# Altium schematic sheet 38-TEST HEADER.SchDoc
size 513 x 386 mm
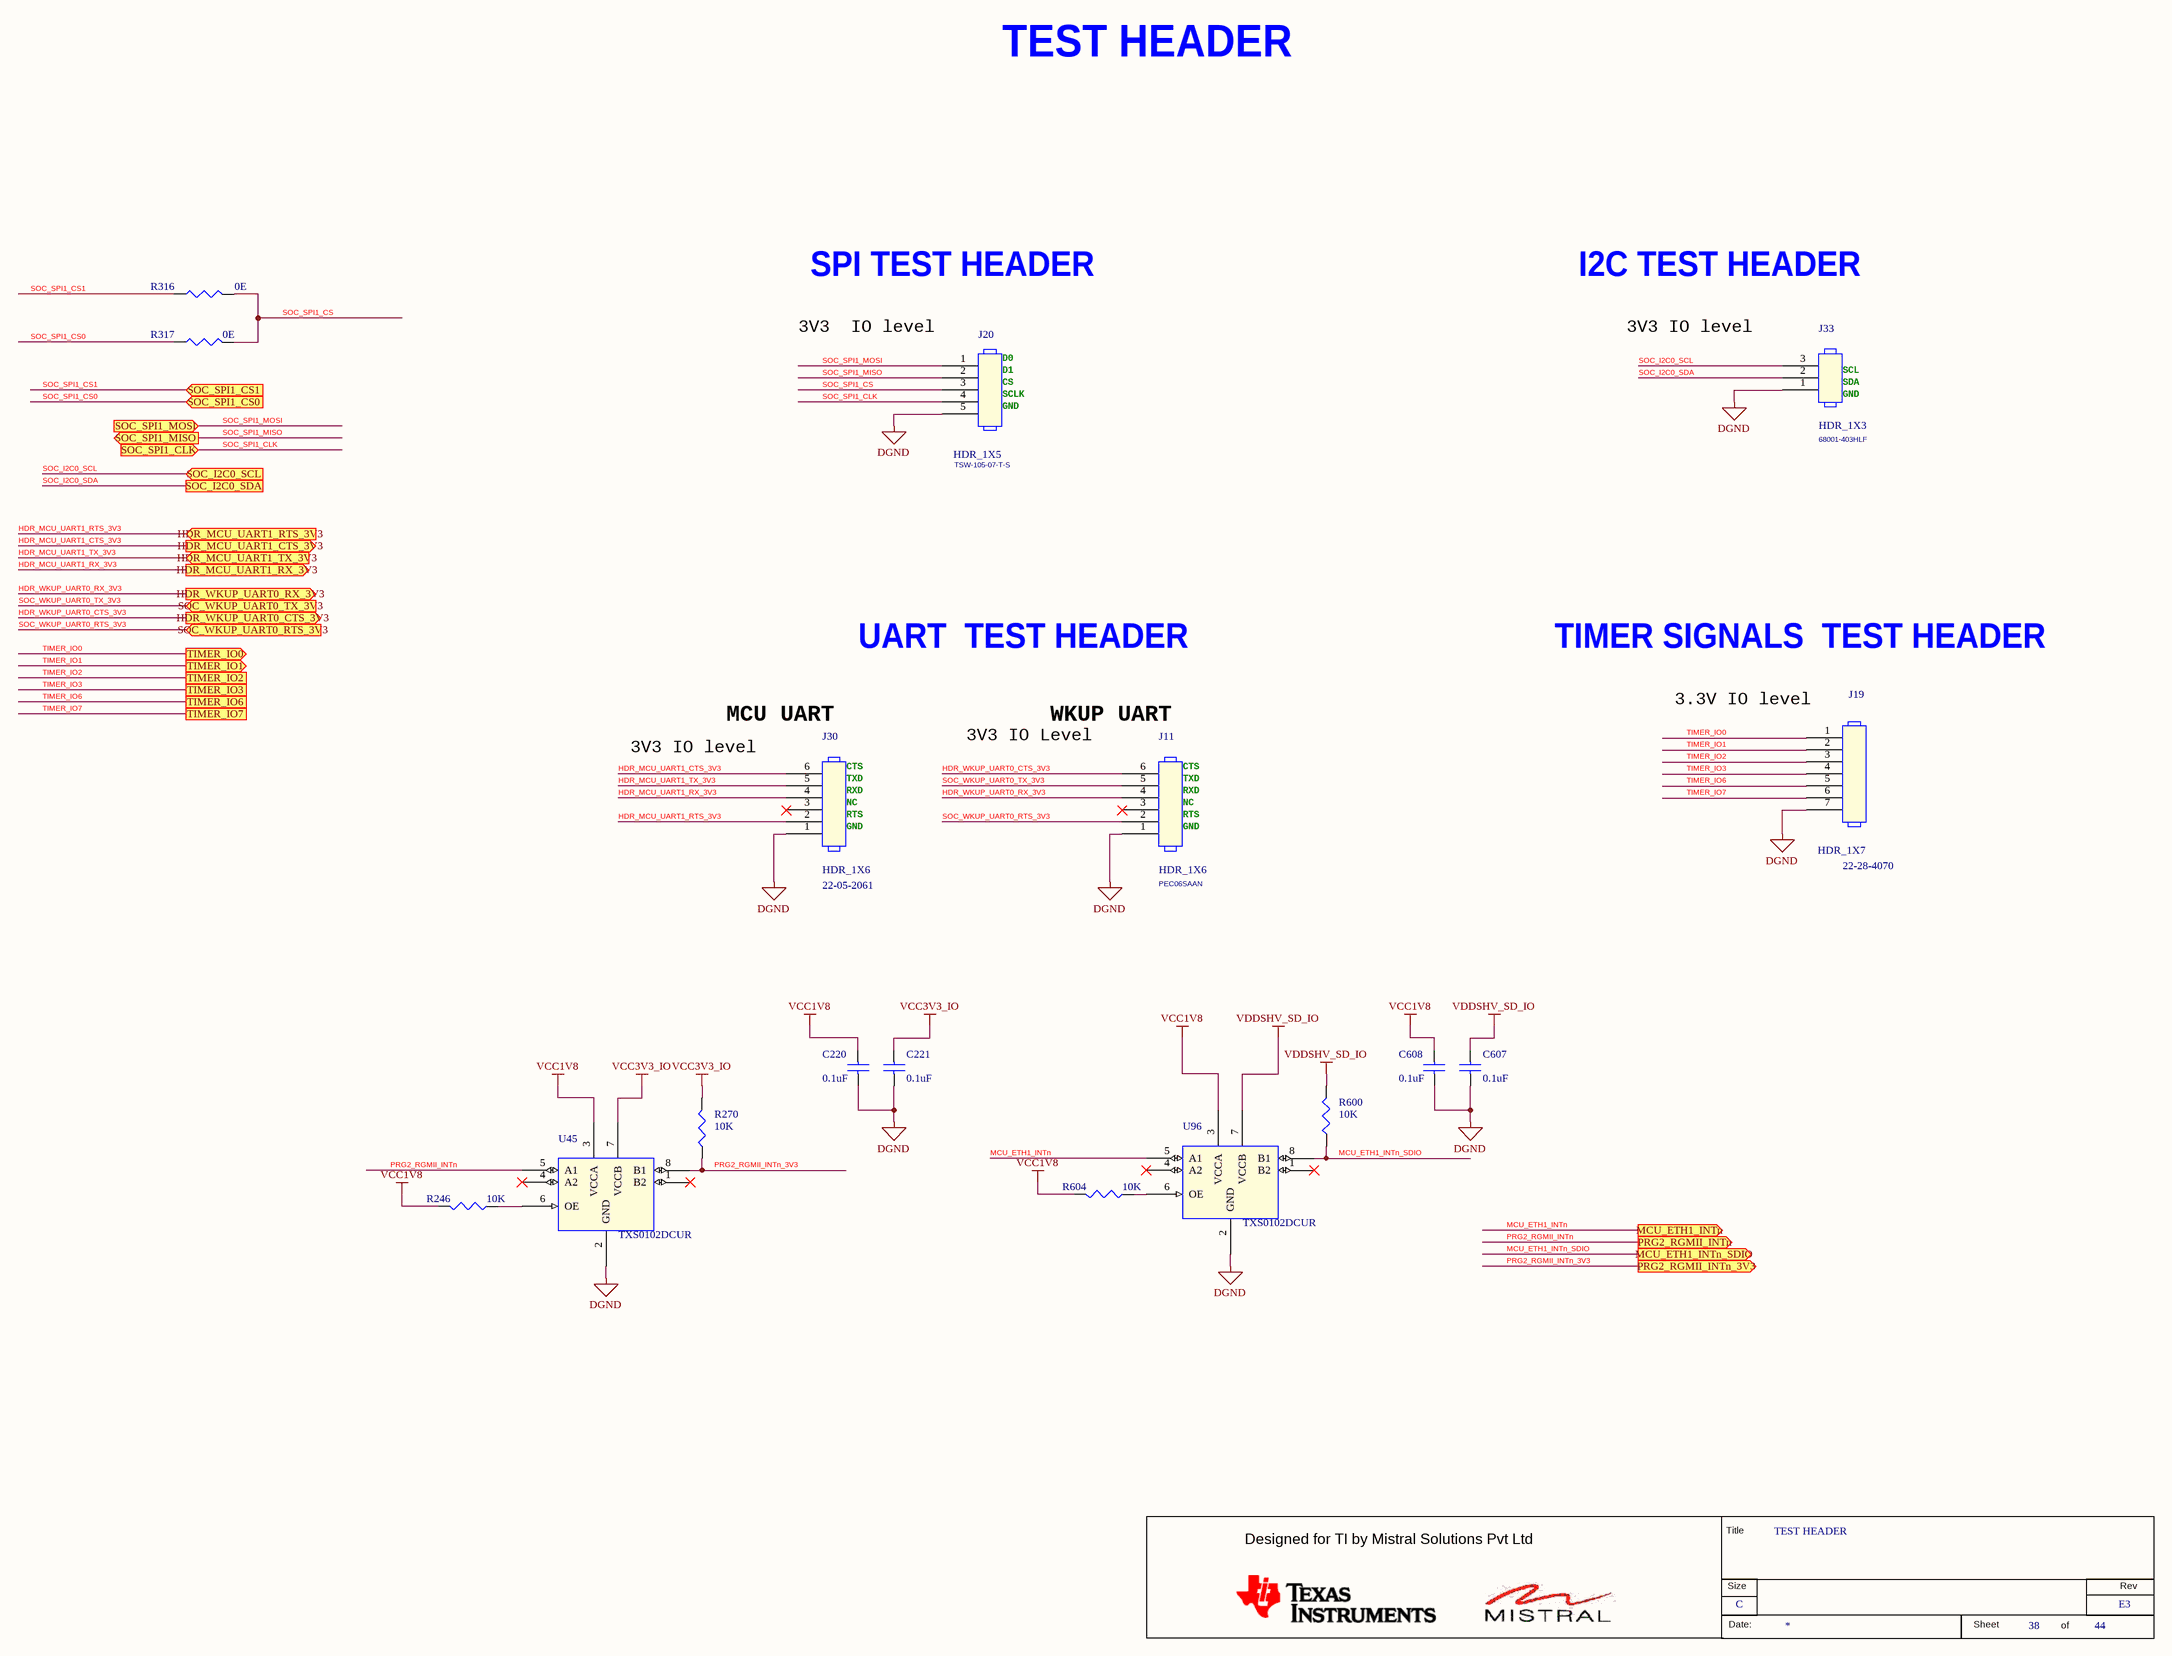
[diagram p0: 38-TEST HEADER.SchDoc]

## Parts
*  RevCode: E3  Title: TEST HEADER  Page Size: C  Page Number: 38  Page Count: 44  (hidden comment: MISTRAL_TITLEBLK_CSIZE)  (graphical)
C220  0.1uF  [CAP0201_0-5]
C221  0.1uF  [CAP0201_0-5]
C607  0.1uF  [CAP0201_0-5]
C608  0.1uF  [CAP0201_0-5]
J11  HDR_1X6  Mfr_part_number: PEC06SAAN  [HDR_6X1_100_S_T]
J19  HDR_1X7  Mfr_part_number: 22-28-4070  [HDR_1X7_22284070_S_T_8-4]
J20  HDR_1X5  Mfr_part_number: TSW-105-07-T-S  [HDR_5X1_100_S_T_8-4]
J30  HDR_1X6  Mfr_part_number: 22-05-2061  [HDR_1X6_22052061_R_T_6-3]
J33  HDR_1X3  Mfr_part_number: 68001-403HLF  [HDR_3X1_100_S_T]
R246  10K  [RES0402_0-5]
R270  10K  [RES0402_0-5]
R316  0E  [RES0402_0-5]
R317  0E  [RES0402_0-5]
R600  10K  [RES0402_0-5]
R604  10K  [RES0402_0-5]
U45  TXS0102DCUR  [VSSOP8_19-68_85X95_0-9]
U96  TXS0102DCUR  [VSSOP8_19-68_85X95_0-9]

## Ports
HDR_MCU_UART1_CTS_3V3 (out), HDR_MCU_UART1_RTS_3V3 (in), HDR_MCU_UART1_RX_3V3 (out), HDR_MCU_UART1_TX_3V3 (in), HDR_WKUP_UART0_CTS_3V3 (out), HDR_WKUP_UART0_RX_3V3 (out), MCU_ETH1_INTn (out), MCU_ETH1_INTn_SDIO (out), PRG2_RGMII_INTn (out), PRG2_RGMII_INTn_3V3 (out), SOC_I2C0_SCL (in), SOC_I2C0_SDA, SOC_SPI1_CLK (in), SOC_SPI1_CS0 (in), SOC_SPI1_CS1 (in), SOC_SPI1_MISO (out), SOC_SPI1_MOSI (in), SOC_WKUP_UART0_RTS_3V3 (in), SOC_WKUP_UART0_TX_3V3 (in), TIMER_IO0 (out), TIMER_IO1 (out), TIMER_IO2, TIMER_IO3, TIMER_IO6, TIMER_IO7

## Nets
DGND: C220.2 C221.2 C607.2 C608.2 J11.1 J19.7 J20.5 J30.1 J33.1 U45.2(GND) U96.2(GND)
VCC1V8: C220.1 C608.1 R246.2 R604.2 U45.3(VCCA) U96.3(VCCA)
VCC3V3_IO: C221.1 R270.2 U45.7(VCCB)
VDDSHV_SD_IO: C607.1 R600.2 U96.7(VCCB)
HDR_MCU_UART1_CTS_3V3: J30.6 ; port HDR_MCU_UART1_CTS_3V3
HDR_MCU_UART1_RTS_3V3: J30.2 ; port HDR_MCU_UART1_RTS_3V3
HDR_MCU_UART1_RX_3V3: J30.4 ; port HDR_MCU_UART1_RX_3V3
HDR_MCU_UART1_TX_3V3: J30.5 ; port HDR_MCU_UART1_TX_3V3
HDR_WKUP_UART0_CTS_3V3: J11.6 ; port HDR_WKUP_UART0_CTS_3V3
HDR_WKUP_UART0_RX_3V3: J11.4 ; port HDR_WKUP_UART0_RX_3V3
MCU_ETH1_INTn: U96.5(A1) ; port MCU_ETH1_INTn
MCU_ETH1_INTn_SDIO: R600.1 U96.8(B1) ; port MCU_ETH1_INTn_SDIO
PRG2_RGMII_INTn: U45.5(A1) ; port PRG2_RGMII_INTn
PRG2_RGMII_INTn_3V3: R270.1 U45.8(B1) ; port PRG2_RGMII_INTn_3V3
SOC_I2C0_SCL: J33.3 ; port SOC_I2C0_SCL
SOC_I2C0_SDA: J33.2 ; port SOC_I2C0_SDA
SOC_SPI1_CLK: J20.4 ; port SOC_SPI1_CLK
SOC_SPI1_CS: J20.3 R316.1 R317.1
SOC_SPI1_CS0: R317.2 ; port SOC_SPI1_CS0
SOC_SPI1_CS1: R316.2 ; port SOC_SPI1_CS1
SOC_SPI1_MISO: J20.2 ; port SOC_SPI1_MISO
SOC_SPI1_MOSI: J20.1 ; port SOC_SPI1_MOSI
SOC_WKUP_UART0_RTS_3V3: J11.2 ; port SOC_WKUP_UART0_RTS_3V3
SOC_WKUP_UART0_TX_3V3: J11.5 ; port SOC_WKUP_UART0_TX_3V3
TIMER_IO0: J19.1 ; port TIMER_IO0
TIMER_IO1: J19.2 ; port TIMER_IO1
TIMER_IO2: J19.3 ; port TIMER_IO2
TIMER_IO3: J19.4 ; port TIMER_IO3
TIMER_IO6: J19.5 ; port TIMER_IO6
TIMER_IO7: J19.6 ; port TIMER_IO7
NetR246_1: R246.1 U45.6(OE)
NetR604_1: R604.1 U96.6(OE)

Not connected (* = marked no-connect by the designer): J11 3*; J30 3*; U45 1(B2)* 4(A2)*; U96 1(B2)* 4(A2)*

## Notes on the sheet
- TEST HEADER
- SPI TEST HEADER
- I2C TEST HEADER
- 3V3  IO level
- 3V3 IO level
- (near J20) SCLK
- (near J20) D0
- (near J20) D1
- (near J20) CS
- (near J20) GND
- (near J33) SCL
- (near J33) SDA
- (near J33) GND
- UART  TEST HEADER
- TIMER SIGNALS  TEST HEADER
- 3.3V IO level
- (near J30) MCU UART
- (near J30) CTS
- 3V3 IO Level
- (near J11) WKUP UART
- (near J11) CTS
- (near J30) GND
- (near J30) TXD
- (near J30) RTS
- (near J30) RXD
- (near J30) NC
- (near J11) GND
- (near J11) TXD
- (near J11) RTS
- (near J11) RXD
- (near J11) NC
- (in symbol MISTRAL_TITLEBLK_CSIZE) Title; Designed for TI by Mistral Solutions Pvt Ltd; Size; Rev; Date:; Sheet; of

## Library data of the parts
* = MISTRAL_TITLEBLK_CSIZE: Issue: 1.0; Page Create Date: March  8, 1995; Page Modify Date: *
C220 C608 = CAP_Dup5: CAP CERAMIC 0.1uF 16V 10% X5R 0201; Part_type: CAPACITORS\CERAMIC; Mfr_part_number: GRM033R61C104KE84J; Mfr_name: MURATA; Mistral Part No: 120009030072-R; Custom_Duty: 15%; Customs_HS_Code: 85322990; Wattage: NA; Project: TI_MAXIE_CPB; Library Ref: CAP; PCB Footprint: CAP0201_0-5; MECHANICAL 3D STEP FILE: CAP0201_0-5; Chkd/date: MANIRAJA/120218; Crtd /date: MANIRAJA/120218; Datasheet: Y:\MIS_DATABASE\DATASHEETS\CAPACITORS\GRM033R61C104KE84.PDF; Temperature: -55°C+85°C; Weight: 0.33mg; Height: 0.33MM; Distributor_part_number: 490-16742-1-ND; Distributor_name: DIGIKEY; Package: 0201; Voltage: 16V; Tolerance: 10%
C221 C607 = CAP_Dup5: CAP CERAMIC 0.1uF 16V 10% X5R 0201; Mistral Part No: 120009030072-R; Mfr_name: MURATA; Mfr_part_number: GRM033R61C104KE84J; Part_type: CAPACITORS\CERAMIC; Project: TI_MAXIE_CPB; Wattage: NA; Customs_HS_Code: 85322990; Custom_Duty: 15%; Library Ref: CAP; PCB Footprint: CAP0201_0-5; Tolerance: 10%; Voltage: 16V; Package: 0201; Distributor_name: DIGIKEY; Distributor_part_number: 490-16742-1-ND; Height: 0.33MM; Weight: 0.33mg; Temperature: -55°C+85°C; Datasheet: Y:\MIS_DATABASE\DATASHEETS\CAPACITORS\GRM033R61C104KE84.PDF; Crtd /date: MANIRAJA/120218; Chkd/date: MANIRAJA/120218; MECHANICAL 3D STEP FILE: CAP0201_0-5
J11 = HEADER_6X1: HDR 1X6 2.54 PITCH ST TH; Mistral Part No: 150016060022-R; Mfr_name: SULLINS; Part_type: CONNECTOR\HEADERS; Project: NTR_GPSDO BOX CARD; Tolerance: NA; Customs_HS_Code: 85369090; Custom_Duty: 24%; Library Ref: HEADER_6X1; PCB Footprint: HDR_6X1_100_S_T; Voltage: NA; Wattage: NA; Package: THRU HOLE; Distributor_name: DIGIKEY; Distributor_part_number: S1012E-06-ND; Height: 8.38MM; Weight: NA; Temperature: -65°C+125°C; Datasheet: Y:\MIS_DATABASE\DATASHEETS\CONNECTORS\PECXXX_SERIES.PDF; Crtd /date: VASANTHA/220616; Chkd/date: VASANTHA/220616
J19 = HEADER_7X1: CON HDR 1X7 2.54MM PITCH ST TH; Part_type: CONNECTOR\HEADERS; Mfr_name: MOLEX; Mistral Part No: 150018010021-R; Custom_Duty: 24%; Customs_HS_Code: 85369090; Wattage: NA; Project: TI_MAXIE_CPB; Library Ref: HEADER_7X1; MECHANICAL 3D STEP FILE: HDR_1X7_22284070_S_T_8-4; Chkd/date: MANIRAJA/230118; Crtd /date: ALVY/230118; Datasheet: Y:\MIS_DATABASE\DATASHEETS\CONNECTORS\22-28-SER.PDF; Temperature: NA; Weight: 431mg; Height: 8.38MM; Distributor_part_number: WM50014-07-ND; Distributor_name: DIGIKEY; Package: THRU-HOLE; Voltage: NA; Tolerance: NA; PCB Footprint: HDR_1X7_22284070_S_T_8-4
J20 = HEADER_5X1: CON HDR 1X5 2.54MM PITCH ST TH; Part_type: CONNECTOR\HEADERS; Mfr_name: SAMTEC; Mistral Part No: 150017090001-R; Custom_Duty: 24%; Customs_HS_Code: 85369090; Wattage: NA; Project: TI_MAXIE_CPB; Library Ref: HEADER_5X1; PCB Footprint: HDR_5X1_100_S_T_8-4; MECHANICAL 3D STEP FILE: HDR_5X1_100_S_T_8-4; Chkd/date: MANIRAJA/010917; Crtd /date: MANIRAJA/010917; Datasheet: Y:\MIS_DATABASE\DATASHEETS\CONNECTORS\TSW-MK.PDF; Temperature: -55°C+105°C; Weight: NA; Height: 8.38MM; Distributor_part_number: SAM1035-05-ND; Distributor_name: DIGIKEY; Package: THRU-HOLE; Voltage: NA; Tolerance: NA
J30 = HEADER_6X1: CON HDR 1X6 2.54MM PITCH RT TH; Mistral Part No: 150018010023-R; Mfr_name: MOLEX; Part_type: CONNECTOR\HEADERS; Project: TI_MAXIE_CPB; Tolerance: NA; Customs_HS_Code: 85369090; Custom_Duty: 24%; Library Ref: HEADER_6X1; Voltage: NA; Wattage: NA; Package: THRU-HOLE; Distributor_name: DIGIKEY; Distributor_part_number: WM4104-ND; Height: 6.30MM; Weight: 484mg; Temperature: NA; Datasheet: Y:\MIS_DATABASE\DATASHEETS\CONNECTORS\A-4094-SER.PDF; Crtd /date: MANIRAJA/240118; Chkd/date: MANIRAJA/240118; PCB Footprint: HDR_1X6_22052061_R_T_6-3; MECHANICAL 3D STEP FILE: HDR_1X6_22052061_R_T_6-3
J33 = HEADER_3X1: HDR 1X3 2.54MM PITCH ST TH; Part_type: CONNECTOR\HEADERS; Mfr_name: FCI; Mistral Part No: 150016060025-R; Custom_Duty: 15%; Customs_HS_Code: 85322990; Wattage: NA; Project: IKEYP; Library Ref: HEADER_3X1; PCB Footprint: HDR_3X1_100_S_T; Chkd/date: VASANTHA/290616; Crtd /date: VASANTHA/290616; Datasheet: Y:\MIS_DATABASE\DATASHEETS\CONNECTORS\68000.PDF; Temperature: -40°C+105°C; Weight: NA; Height: 8.58MM; Distributor_part_number: 609-3471-ND; Distributor_name: DIGIKEY; Package: THRU-HOLE; Voltage: NA; Tolerance: NA
R246 R270 R604 = RESISTOR_Dup5: RES 10K 1/16W 5% 0402; Part_type: RESISTORS\FIXED; Mfr_part_number: RC0402JR-0710KL; Mfr_name: YAGEO AMERICA; Mistral Part No: 110009030208-R; Custom_Duty: 15%; Customs_HS_Code: 85332119; Voltage: NA; Project: HSE; Footprint Path: Y:\MIS_DATABASE\Library\ALTIUM_TOOL\PCB_FOOTPRINTS\Altium_Footprint_Lib.PcbLib; Library Path: Y:\MIS_DATABASE\Library\ALTIUM_TOOL\SCHEMATICS_PARTS\MS_DISCRETE_Library.schlib; Footprint Ref: RES0402_0-5; Library Ref: RESISTOR; PCB Footprint: RES0402_0-5; MECHANICAL 3D STEP FILE: RES0402_0-5; RoHS: Pb-Free; Chkd/date: VASANTHA/061216; Crtd /date: MAZHAR/230805; Datasheet: Y:\MIS_DATABASE\DATASHEETS\RESISTORS\YAGEO-RC0402.PDF; Temperature: -55°C+155°C; Weight: 0.65mg; Height: 0.40MM; Distributor_part_number: 311-10KJRCT-ND; Distributor_name: DIGIKEY; Package: 0402; Wattage: 1/16W; Tolerance: 5%
R316 = RESISTOR_Dup4: RES 0E 1/16W 0402; Part_type: RESISTORS\FIXED; Mfr_part_number: CRCW04020000Z0ED; Mfr_name: VISHAY; Mistral Part No: 110010080019-P; Custom_Duty: 15%; Customs_HS_Code: 85332119; Voltage: NA; Project: PB_BUGBASE; NI_MARK: DNI; Footprint Path: Y:\MIS_DATABASE\Library\ALTIUM_TOOL\PCB_FOOTPRINTS\Altium_Footprint_Lib.PcbLib; Library Path: Y:\MIS_DATABASE\Library\ALTIUM_TOOL\SCHEMATICS_PARTS\MS_DISCRETE_Library.schlib; Footprint Ref: RES0402_0-5; Library Ref: RESISTOR; RoHS: Pb-Free; Chkd/date: VASANTHA/201216; Crtd /date: MUDDU/190810; Datasheet: Y:\MIS_DATABASE\DATASHEETS\RESISTORS\CRCW0603.PDF; Temperature: -55°C+155°C; Weight: 0.65g/1000pcs; Height: 0.40MM; Distributor_part_number: 541-0.0JCT-ND; Distributor_name: DIGIKEY; Package: 0402; Wattage: 1/16W; Tolerance: NA; PCB Footprint: RES0402_0-5; MECHANICAL 3D STEP FILE: RES0402_0-5
R317 = RESISTOR_Dup4: RES 0E 1/16W 0402; Mistral Part No: 110010080019-P; Mfr_name: VISHAY; Mfr_part_number: CRCW04020000Z0ED; Part_type: RESISTORS\FIXED; Project: PB_BUGBASE; Tolerance: NA; Customs_HS_Code: 85332119; Custom_Duty: 15%; NI_MARK: DNI; Footprint Path: Y:\MIS_DATABASE\Library\ALTIUM_TOOL\PCB_FOOTPRINTS\Altium_Footprint_Lib.PcbLib; Library Path: Y:\MIS_DATABASE\Library\ALTIUM_TOOL\SCHEMATICS_PARTS\MS_DISCRETE_Library.schlib; Footprint Ref: RES0402_0-5; Library Ref: RESISTOR; Voltage: NA; Wattage: 1/16W; Package: 0402; Distributor_name: DIGIKEY; Distributor_part_number: 541-0.0JCT-ND; Height: 0.40MM; Weight: 0.65g/1000pcs; Temperature: -55°C+155°C; Datasheet: Y:\MIS_DATABASE\DATASHEETS\RESISTORS\CRCW0603.PDF; Crtd /date: MUDDU/190810; Chkd/date: VASANTHA/201216; RoHS: Pb-Free; PCB Footprint: RES0402_0-5; MECHANICAL 3D STEP FILE: RES0402_0-5
R600 = RESISTOR_Dup5: RES 10K 1/16W 5% 0402; Mistral Part No: 110009030208-R; Mfr_name: YAGEO AMERICA; Mfr_part_number: RC0402JR-0710KL; Part_type: RESISTORS\FIXED; Project: HSE; Voltage: NA; Customs_HS_Code: 85332119; Custom_Duty: 15%; Footprint Path: Y:\MIS_DATABASE\Library\ALTIUM_TOOL\PCB_FOOTPRINTS\Altium_Footprint_Lib.PcbLib; Library Path: Y:\MIS_DATABASE\Library\ALTIUM_TOOL\SCHEMATICS_PARTS\MS_DISCRETE_Library.schlib; Footprint Ref: RES0402_0-5; Library Ref: RESISTOR; PCB Footprint: RES0402_0-5; Tolerance: 5%; Wattage: 1/16W; Package: 0402; Distributor_name: DIGIKEY; Distributor_part_number: 311-10KJRCT-ND; Height: 0.40MM; Weight: 0.65mg; Temperature: -55°C+155°C; Datasheet: Y:\MIS_DATABASE\DATASHEETS\RESISTORS\YAGEO-RC0402.PDF; Crtd /date: MAZHAR/230805; Chkd/date: VASANTHA/061216; RoHS: Pb-Free; MECHANICAL 3D STEP FILE: RES0402_0-5
U45 U96 = TXS0102DCUR_VSSOP8: IC 2BIT BI-DIR VOLTAGE-LEVEL TRANSLATOR US8(VSSOP8); Mistral Part No: 141009030376-R; Mfr_name: TEXAS INSTRUMENTS; Part_type: ICS\INTERFACE\LEVEL TRANSLATOR; Project: SD_WATERLOO; Tolerance: NA; Customs_HS_Code: 85423100; Custom_Duty: 15%; Footprint Ref: VSSOP8_19-68_85X95_0-9; Library Ref: TXS0102DCUR_VSSOP8; PCB Footprint: VSSOP8_19-68_85X95_0-9; Mfr_part_number: TXS0102DCUR; Voltage: NA; Wattage: NA; Package: US8; Distributor_name: DIGIKEY; Distributor_part_number: 296-21931-1-ND; Height: 0.90MM; Weight: 9.6mg; Temperature: -40°C+85°C; Datasheet: Y:\MIS_DATABASE\DATASHEETS\ICS\INTERFACE\TXS0102.PDF; Crtd /date: SHREESHAIL/190108; Chkd/date: MANIRAJA/130617; MECHANICAL 3D STEP FILE: VSSOP8_19-68_85X95_0-9; Library Path: Y:\MIS_DATABASE\Library\ALTIUM_TOOL\SCHEMATICS_PARTS\MS_MISCINTERFACE_Library.schlib; Footprint Path: Y:\MIS_DATABASE\Library\ALTIUM_TOOL\PCB_FOOTPRINTS\Altium_Footprint_Lib.PcbLib